# Altium schematic sheet llrf_afe_pwr_single_ch.SchDoc: =GlobalProjectName
size 209 x 297 mm; SheetNumber: 8; SheetTotal: 17; PageSetup: Record=PageOptions|CenterHorizontal=True|CenterVertical=True|PrintScale=1.00|XCorrection=1.00|YCorrection=1.00|PrintKind=1|BorderSize=5000000|LeftOffset=0|BottomOffset=0|Orientation=2|PaperLength=1000|PaperWidth=1000|Scale=100|PaperSource=15|PrintQuality=1200|MediaType=1|DitherType=10|PaperKind=A3|PrintScaleMode=1; Weight: -; ScaleFactor: -
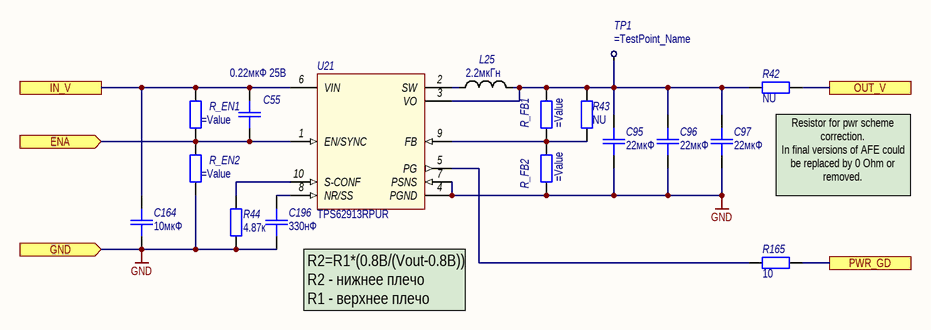
[diagram p0: llrf_afe_pwr_single_ch.SchDoc]

## Parts
C55  0.22мкФ 25В  [SMD_C0603]
C95  22мкФ  [SMD_C0805]
C96  22мкФ  [SMD_C0805]
C97  22мкФ  [SMD_C0805]
C164  10мкФ  [SMD_C0805]
C196  330нФ  [SMD_C0402]
L25  value 2.2мкГн  [SMD_1210]  (hidden comment: Inductor)
R42  NU  [SMD_1206]
R43  NU  [SMD_0603]
R44  4.87к  [SMD_0603]
R165  10  [SMD_0603]
R_EN1  (no value)  [SMD_0603]
R_EN2  (no value)  [SMD_0603]
R_FB1  (no value)  [SMD_0603]
R_FB2  (no value)  [SMD_0603]
TP1  (no value)  [TestPoint]
U21  Наименование: TPS62913RPUR  [RPU0010A]  (hidden comment: TPS62913)

## Ports
ENA (in), GND (in), IN_V, OUT_V, PWR_GD

## Nets
GND: C95.1 C96.1 C97.1 C164.1 C196.1 R44.1 R_EN2.1 R_FB2.1 U21.4(PGND) U21.7(PSNS) ; port GND
ENA: C55.1 R_EN1.1 R_EN2.2 U21.1(EN/SYNC) ; port ENA
IN_V: C55.2 C164.2 R_EN1.2 U21.6(VIN) ; port IN_V
OUT_V: R42.1 ; port OUT_V
PWR_GD: R165.1 ; port PWR_GD
NetC95_2: C95.2 C96.2 C97.2 L25.2 R42.2 R43.2 R_FB1.2 TP1.0(TP) U21.3(VO)
NetC196_2: C196.2 U21.8(NR/SS)
NetL25_1: L25.1 U21.2(SW)
NetR43_1: R43.1 R_FB1.1 R_FB2.2 U21.9(FB)
NetR44_2: R44.2 U21.10(S-CONF)
NetR165_2: R165.2 U21.5(PG)

## Notes on the sheet
- (near R42) Resistor for pwr scheme correction.
  In final versions of AFE could be replaced by 0 Ohm or removed.
- (near C196) R2=R1*(0.8В/(Vout-0.8B))
  R2 - нижнее плечо
  R1 - верхнее плечо
- Подп. и дата
- Инв. № дубл.
- Взам. инв. №
- Инв. № подл.
- Изм.
- Лист
- № докум.
- Подп.
- Дата
- Форма 2а ГОСТ 2.104-2006
- Копировал
- Формат А4

## Library data of the parts
C55 = Capacitor: Назначение: SMD-конденсатор; Наименование: Конденсатор; Потребление, Вт: 0; Value: 0.22мкФ 25В
C95-C97 = Capacitor: Назначение: SMD-конденсатор; Наименование: Конденсатор; Потребление, Вт: 0; Диэлектрик: X7R; Точность: 10%; Напряжение: 25В; Описание: Конденсатор X7R 22мкФ 10% 25В; Value: 22мкФ
C164 = Capacitor: Назначение: SMD-конденсатор; Наименование: Конденсатор; Потребление, Вт: 0; Диэлектрик: X7R; Точность: 10%; Напряжение: 25В; Описание: Конденсатор X7R 10мкФ 10% 25В; Value: 10мкФ
C196 = Capacitor: Назначение: SMD-конденсатор; Наименование: Конденсатор; Потребление, Вт: 0; Диэлектрик: X7R; Точность: 10%; Напряжение: 25В; Описание: Конденсатор X7R 330нФ 10% 25В; Value: 330нФ
L25 = Inductor: Наименование: Индуктивность; Назначение: SMD-индуктивность; Потребление, Вт: 0,010
R42 R43 R165 R_EN1 R_EN2 R_FB1 R_FB2 = Resistor: Наименование: Резистор; Назначение: SMD-резистор; Потребление, Вт: 0,001
  R42 R43: Value: NU
  R165: Value: 10
  R_EN1: Value: =R_EN1
  R_EN2: Value: =R_EN2
  R_FB1: Value: =R_FB1
  R_FB2: Value: =R_FB2
R44 = Resistor: Наименование: Резистор; Назначение: SMD-резистор; Потребление, Вт: 0.0; Точность: 1%; Описание: Резистор 4.87к 1%; Value: 4.87к
TP1 = TP: Наименование: Точка проверки; Назначение: Контроль параметров платы; TP_Name: =TestPoint_Name
U21 = TPS62913: TPS62913 3-V to 17-V, 3-A Low Noise and Low Ripple Buck Converter; Потребление, Вт: 0.0; Назначение: Buck Converter; ComponentLink1Description: DataSheet; ComponentLink1URL: https://www.ti.com/lit/ds/symlink/tps62913.pdf?ts=1639989978788&ref_url=https%253A%252F%252Fwww.ti.com%252Fproduct%252FTPS62913